# Altium schematic sheet Board.SchDoc
size A4; SheetNumber: 1; SheetTotal: 5
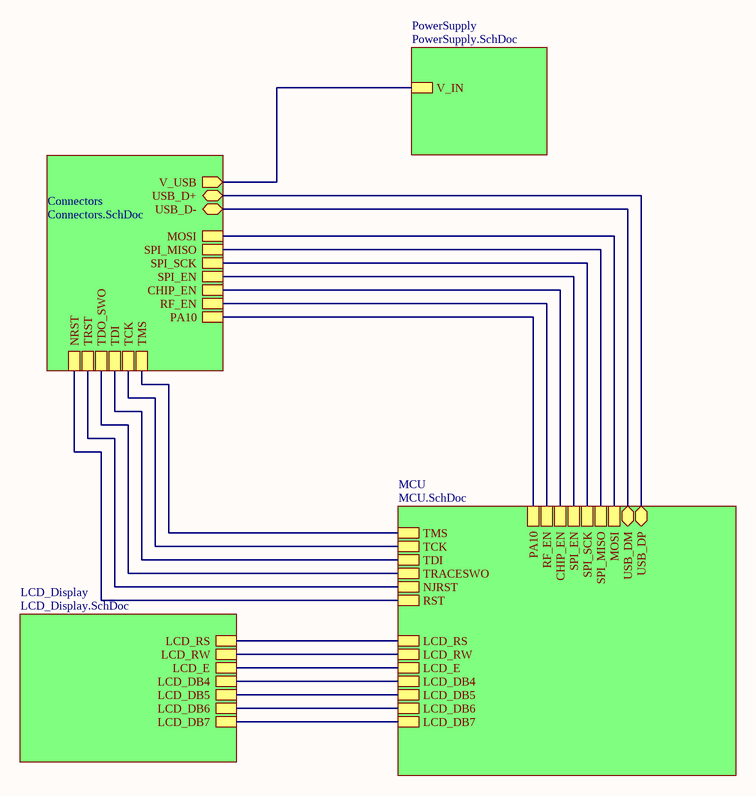
[diagram p0: Board.SchDoc]

## Sub-sheets
Connectors = Connectors.SchDoc: USB_D+ (bidir), USB_D- (bidir), V_USB (out), TMS, TCK, TDI, TDO_SWO, TRST, NRST, MOSI, SPI_MISO, SPI_SCK, SPI_EN, CHIP_EN, RF_EN, PA10
LCD_Display = LCD_Display.SchDoc: LCD_RS, LCD_RW, LCD_E, LCD_DB4, LCD_DB6, LCD_DB5, LCD_DB7
MCU = MCU.SchDoc: USB_DM (bidir), USB_DP (bidir), TMS, TCK, TDI, TRACESWO, NJRST, RST, LCD_RS, LCD_RW, LCD_E, LCD_DB4, LCD_DB6, LCD_DB5, LCD_DB7, MOSI, SPI_MISO, SPI_SCK, SPI_EN, CHIP_EN, RF_EN, PA10
PowerSupply = PowerSupply.SchDoc: V_IN

## Nets
(unnamed): sheet Connectors/USB_D+, sheet MCU/USB_DP
(unnamed): sheet Connectors/USB_D-, sheet MCU/USB_DM
(unnamed): sheet Connectors/V_USB, sheet PowerSupply/V_IN
(unnamed): sheet Connectors/TMS, sheet MCU/TMS
(unnamed): sheet Connectors/TCK, sheet MCU/TCK
(unnamed): sheet Connectors/TDI, sheet MCU/TDI
(unnamed): sheet Connectors/TDO_SWO, sheet MCU/TRACESWO
(unnamed): sheet Connectors/TRST, sheet MCU/NJRST
(unnamed): sheet Connectors/NRST, sheet MCU/RST
(unnamed): sheet Connectors/MOSI, sheet MCU/MOSI
(unnamed): sheet Connectors/SPI_MISO, sheet MCU/SPI_MISO
(unnamed): sheet Connectors/SPI_SCK, sheet MCU/SPI_SCK
(unnamed): sheet Connectors/SPI_EN, sheet MCU/SPI_EN
(unnamed): sheet Connectors/CHIP_EN, sheet MCU/CHIP_EN
(unnamed): sheet Connectors/RF_EN, sheet MCU/RF_EN
(unnamed): sheet Connectors/PA10, sheet MCU/PA10
(unnamed): sheet LCD_Display/LCD_RS, sheet MCU/LCD_RS
(unnamed): sheet LCD_Display/LCD_RW, sheet MCU/LCD_RW
(unnamed): sheet LCD_Display/LCD_E, sheet MCU/LCD_E
(unnamed): sheet LCD_Display/LCD_DB4, sheet MCU/LCD_DB4
(unnamed): sheet LCD_Display/LCD_DB6, sheet MCU/LCD_DB6
(unnamed): sheet LCD_Display/LCD_DB5, sheet MCU/LCD_DB5
(unnamed): sheet LCD_Display/LCD_DB7, sheet MCU/LCD_DB7